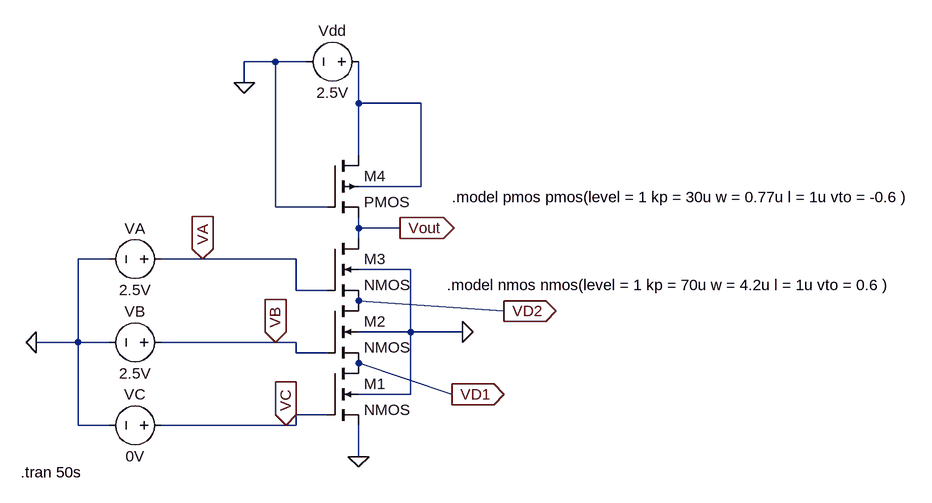
[diagram p0: schematic nand3inputs.asc]
nand3inputs.asc, the LTspice schematic file:
Version 4
SHEET 1 1188 680
WIRE 80 -144 32 -144
WIRE 128 -144 80 -144
WIRE 32 -112 32 -144
WIRE 208 -80 208 -144
WIRE 304 -80 208 -80
WIRE 208 0 208 -80
WIRE 304 48 304 -80
WIRE 304 48 208 48
WIRE 80 80 80 -144
WIRE 160 80 80 80
WIRE 208 112 208 96
WIRE 272 112 208 112
WIRE 208 128 208 112
WIRE -176 160 -224 160
WIRE -32 160 -96 160
WIRE 112 160 -32 160
WIRE 288 176 208 176
WIRE 112 208 112 160
WIRE 160 208 112 208
WIRE 432 240 208 224
WIRE 288 272 288 176
WIRE 288 272 208 272
WIRE 368 272 288 272
WIRE -224 288 -224 160
WIRE -224 288 -288 288
WIRE -176 288 -224 288
WIRE 80 288 -96 288
WIRE 112 288 80 288
WIRE 112 304 112 288
WIRE 160 304 112 304
WIRE 288 368 288 272
WIRE 288 368 208 368
WIRE 352 368 208 320
WIRE 160 400 112 400
WIRE -224 416 -224 288
WIRE -176 416 -224 416
WIRE 96 416 -96 416
WIRE 112 416 112 400
WIRE 112 416 96 416
WIRE 208 464 208 416
FLAG 208 464 0
FLAG 32 -112 0
FLAG 368 272 0
FLAG -288 288 0
FLAG -32 160 VA
IOPIN -32 160 In
FLAG 80 288 VB
IOPIN 80 288 In
FLAG 96 416 VC
IOPIN 96 416 In
FLAG 272 112 Vout
IOPIN 272 112 Out
FLAG 352 368 VD1
IOPIN 352 368 Out
FLAG 432 240 VD2
IOPIN 432 240 Out
SYMBOL pmos4 160 0 R0
SYMATTR InstName M4
SYMBOL nmos4 160 320 R0
SYMATTR InstName M1
SYMBOL nmos4 160 128 R0
SYMATTR InstName M3
SYMBOL voltage 224 -144 R90
WINDOW 0 -32 56 VBottom 2
WINDOW 3 32 56 VTop 2
SYMATTR InstName Vdd
SYMATTR Value 2.5V
SYMBOL voltage -80 160 R90
WINDOW 0 -32 56 VBottom 2
WINDOW 3 32 56 VTop 2
WINDOW 123 0 0 Left 2
WINDOW 39 0 0 Left 2
SYMATTR InstName VA
SYMATTR Value 2.5V
SYMBOL voltage -80 288 R90
WINDOW 0 -32 56 VBottom 2
WINDOW 3 32 56 VTop 2
WINDOW 123 0 0 Left 2
WINDOW 39 0 0 Left 2
SYMATTR InstName VB
SYMATTR Value 2.5V
SYMBOL voltage -80 416 R90
WINDOW 0 -32 56 VBottom 2
WINDOW 3 32 56 VTop 2
WINDOW 123 0 0 Left 2
WINDOW 39 0 0 Left 2
SYMATTR InstName VC
SYMATTR Value 0V
SYMBOL nmos4 160 224 R0
SYMATTR InstName M2
TEXT 352 64 Left 2 !.model pmos pmos(level = 1 kp = 30u w = 0.77u l = 1u vto = -0.6 )
TEXT 344 200 Left 2 !.model nmos nmos(level = 1 kp = 70u w = 4.2u l = 1u vto = 0.6 )
TEXT -312 488 Left 2 !.tran 50s

The netlist it stands for:
* nand3inputs.asc
M4 N001 0 Vout N001 PMOS
M1 VD1 VC 0 0 NMOS
M3 Vout VA VD2 0 NMOS
Vdd N001 0 2.5V
VA VA 0 2.5V
VB VB 0 2.5V
VC VC 0 0V
M2 VD2 VB VD1 0 NMOS
.model NMOS NMOS
.model PMOS PMOS
.lib standard.mos
.model pmos pmos(level = 1 kp = 30u w = 0.77u l = 1u vto = -0.6 )
.model nmos nmos(level = 1 kp = 70u w = 4.2u l = 1u vto = 0.6 )
.tran 50s
.backanno
.end